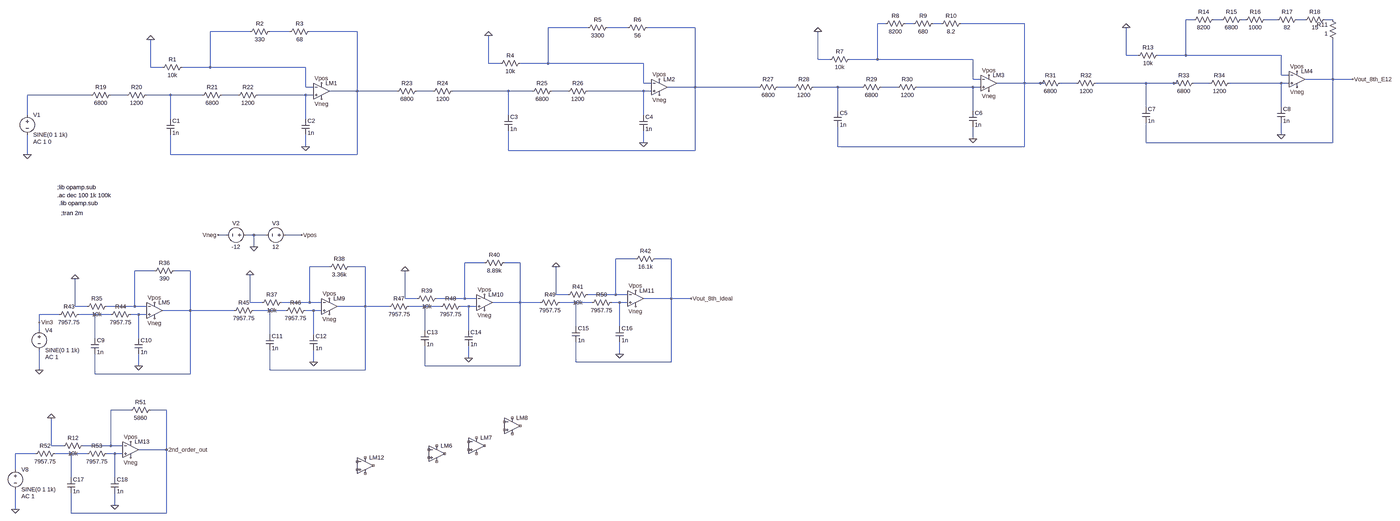
[diagram p0: schematic ESP Prac 1 BW 8th order Anti-Aliasing Filter.asc, whole sheet]
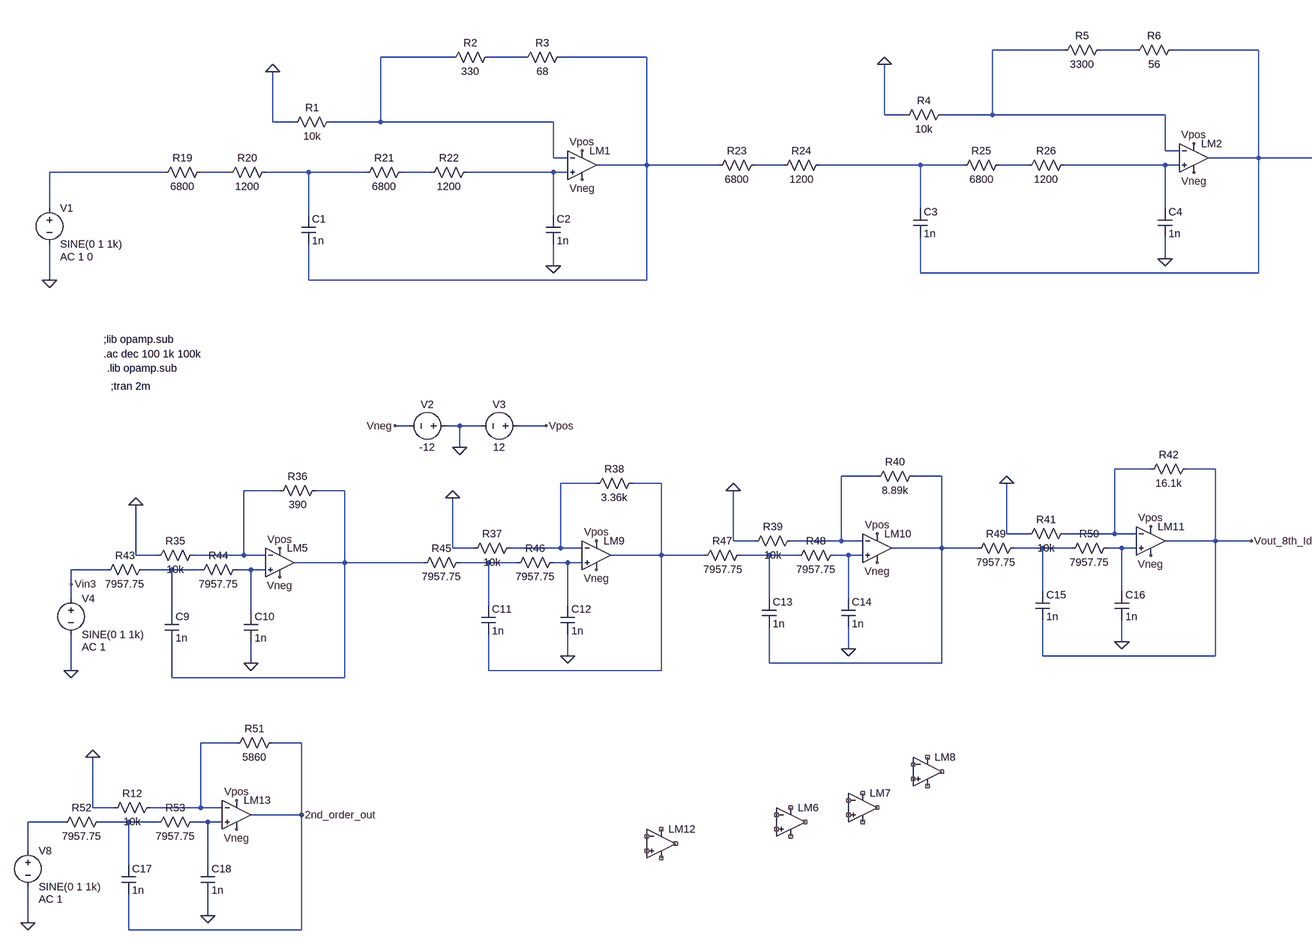
[diagram p1: schematic ESP Prac 1 BW 8th order Anti-Aliasing Filter.asc, part, row 1 of 1, column 1 of 2]
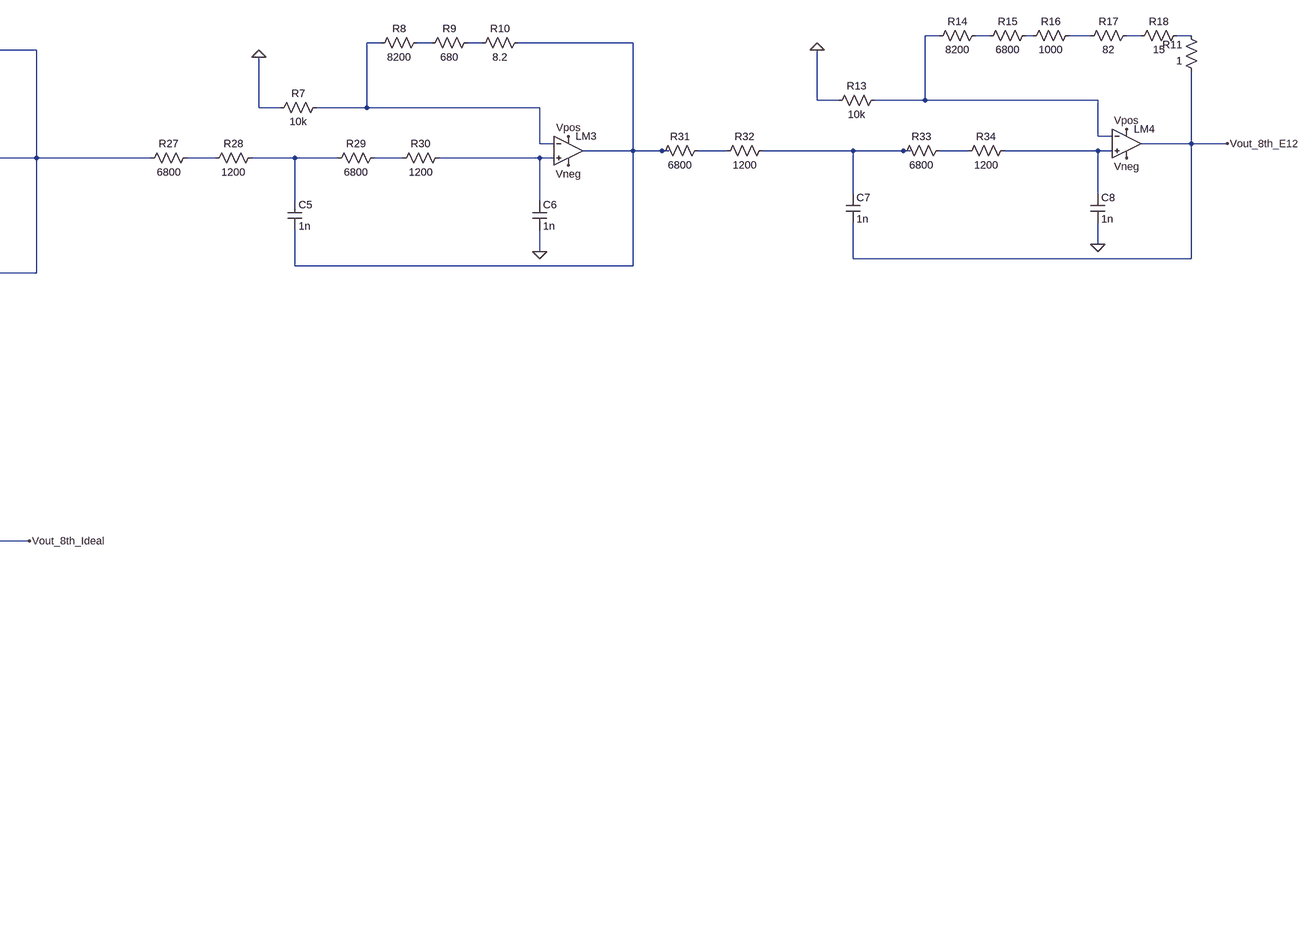
[diagram p2: schematic ESP Prac 1 BW 8th order Anti-Aliasing Filter.asc, part, row 1 of 1, column 2 of 2]
ESP Prac 1 BW 8th order Anti-Aliasing Filter.asc, the LTspice schematic file:
Version 4
SHEET 1 4872 1876
WIRE 4048 -160 4016 -160
WIRE 4160 -160 4128 -160
WIRE 4256 -160 4240 -160
WIRE 4384 -160 4336 -160
WIRE 4496 -160 4464 -160
WIRE 4608 -160 4576 -160
WIRE 2704 -144 2672 -144
WIRE 2816 -144 2784 -144
WIRE 2928 -144 2896 -144
WIRE 3264 -144 3008 -144
WIRE 1456 -128 1296 -128
WIRE 1616 -128 1536 -128
WIRE 1888 -128 1696 -128
WIRE 96 -112 -64 -112
WIRE 256 -112 176 -112
WIRE 528 -112 336 -112
WIRE 3776 -16 3776 -128
WIRE 3824 -16 3776 -16
WIRE 4016 -16 4016 -160
WIRE 4016 -16 3904 -16
WIRE 4400 -16 4016 -16
WIRE 2432 0 2432 -112
WIRE 2480 0 2432 0
WIRE 2672 0 2672 -144
WIRE 2672 0 2560 0
WIRE 3056 0 2672 0
WIRE 1056 16 1056 -96
WIRE 1104 16 1056 16
WIRE 1296 16 1296 -128
WIRE 1296 16 1184 16
WIRE 1680 16 1296 16
WIRE -304 32 -304 -80
WIRE -256 32 -304 32
WIRE -64 32 -64 -112
WIRE -64 32 -176 32
WIRE 320 32 -64 32
WIRE 4400 64 4400 -16
WIRE 4432 64 4400 64
WIRE 3056 80 3056 0
WIRE 3088 80 3056 80
WIRE 4608 80 4608 -80
WIRE 4608 80 4496 80
WIRE 4688 80 4608 80
WIRE 1680 96 1680 16
WIRE 1712 96 1680 96
WIRE 3264 96 3264 -144
WIRE 3264 96 3152 96
WIRE 3328 96 3264 96
WIRE 3344 96 3328 96
WIRE 3472 96 3408 96
WIRE 3856 96 3552 96
WIRE 3968 96 3856 96
WIRE 3984 96 3968 96
WIRE 4112 96 4048 96
WIRE 4400 96 4192 96
WIRE 4432 96 4400 96
WIRE 320 112 320 32
WIRE 352 112 320 112
WIRE 1888 112 1888 -128
WIRE 1888 112 1776 112
WIRE 2192 112 1888 112
WIRE 2336 112 2272 112
WIRE 2512 112 2416 112
WIRE 2608 112 2512 112
WIRE 2752 112 2688 112
WIRE 3056 112 2832 112
WIRE 3088 112 3056 112
WIRE 528 128 528 -112
WIRE 528 128 416 128
WIRE 688 128 528 128
WIRE 832 128 768 128
WIRE 1136 128 912 128
WIRE 1232 128 1136 128
WIRE 1376 128 1312 128
WIRE 1680 128 1456 128
WIRE 1712 128 1680 128
WIRE -544 144 -800 144
WIRE -400 144 -464 144
WIRE -224 144 -320 144
WIRE -96 144 -224 144
WIRE 48 144 -16 144
WIRE 320 144 128 144
WIRE 352 144 320 144
WIRE 3856 192 3856 96
WIRE 4400 192 4400 96
WIRE 2512 208 2512 112
WIRE 3056 208 3056 112
WIRE -800 224 -800 144
WIRE 1136 224 1136 128
WIRE 1680 224 1680 128
WIRE -224 240 -224 144
WIRE 320 240 320 144
WIRE 4400 304 4400 256
WIRE 3056 320 3056 272
WIRE 1680 336 1680 288
WIRE 3856 336 3856 256
WIRE 4608 336 4608 80
WIRE 4608 336 3856 336
WIRE 320 352 320 304
WIRE 2512 352 2512 272
WIRE 3264 352 3264 96
WIRE 3264 352 2512 352
WIRE 1136 368 1136 288
WIRE 1888 368 1888 112
WIRE 1888 368 1136 368
WIRE -800 384 -800 304
WIRE -224 384 -224 304
WIRE 528 384 528 128
WIRE 528 384 -224 384
WIRE 0 736 -32 736
WIRE 112 736 80 736
WIRE 160 736 112 736
WIRE 304 736 240 736
WIRE 112 784 112 736
WIRE 1648 832 1568 832
WIRE 1792 832 1728 832
WIRE 1040 848 960 848
WIRE 1184 848 1120 848
WIRE 416 864 336 864
WIRE 560 864 496 864
WIRE -288 880 -368 880
WIRE -144 880 -208 880
WIRE 1328 976 1328 864
WIRE 1376 976 1328 976
WIRE 1568 976 1568 832
WIRE 1568 976 1456 976
WIRE 1616 976 1568 976
WIRE 720 992 720 880
WIRE 768 992 720 992
WIRE 960 992 960 848
WIRE 960 992 848 992
WIRE 1008 992 960 992
WIRE 1792 992 1792 832
WIRE 1792 992 1680 992
WIRE 1872 992 1792 992
WIRE 96 1008 96 896
WIRE 144 1008 96 1008
WIRE 336 1008 336 864
WIRE 336 1008 224 1008
WIRE 384 1008 336 1008
WIRE 1184 1008 1184 848
WIRE 1184 1008 1072 1008
WIRE 1264 1008 1184 1008
WIRE 1408 1008 1344 1008
WIRE 1472 1008 1408 1008
WIRE 1584 1008 1552 1008
WIRE 1616 1008 1584 1008
WIRE -608 1024 -608 912
WIRE -560 1024 -608 1024
WIRE -368 1024 -368 880
WIRE -368 1024 -480 1024
WIRE -320 1024 -368 1024
WIRE 560 1024 560 864
WIRE 560 1024 448 1024
WIRE 656 1024 560 1024
WIRE 800 1024 736 1024
WIRE 864 1024 800 1024
WIRE 976 1024 944 1024
WIRE 1008 1024 976 1024
WIRE -144 1040 -144 880
WIRE -144 1040 -256 1040
WIRE 32 1040 -144 1040
WIRE 176 1040 112 1040
WIRE 240 1040 176 1040
WIRE 352 1040 320 1040
WIRE 384 1040 352 1040
WIRE -672 1056 -752 1056
WIRE -528 1056 -592 1056
WIRE -464 1056 -528 1056
WIRE -352 1056 -384 1056
WIRE -320 1056 -352 1056
WIRE -752 1088 -752 1056
WIRE 1408 1104 1408 1008
WIRE 1584 1104 1584 1008
WIRE -752 1120 -752 1088
WIRE 800 1120 800 1024
WIRE 976 1120 976 1024
WIRE 176 1136 176 1040
WIRE 352 1136 352 1040
WIRE -528 1152 -528 1056
WIRE -352 1152 -352 1056
WIRE 1584 1216 1584 1168
WIRE 976 1232 976 1184
WIRE 352 1248 352 1200
WIRE 1408 1248 1408 1168
WIRE 1792 1248 1792 992
WIRE 1792 1248 1408 1248
WIRE -352 1264 -352 1216
WIRE 800 1264 800 1184
WIRE 1184 1264 1184 1008
WIRE 1184 1264 800 1264
WIRE -752 1280 -752 1200
WIRE 176 1280 176 1200
WIRE 560 1280 560 1024
WIRE 560 1280 176 1280
WIRE -528 1296 -528 1216
WIRE -144 1296 -144 1040
WIRE -144 1296 -528 1296
WIRE -384 1456 -464 1456
WIRE -240 1456 -304 1456
WIRE -704 1600 -704 1488
WIRE -656 1600 -704 1600
WIRE -464 1600 -464 1456
WIRE -464 1600 -576 1600
WIRE -416 1600 -464 1600
WIRE -240 1616 -240 1456
WIRE -240 1616 -352 1616
WIRE -768 1632 -848 1632
WIRE -624 1632 -688 1632
WIRE -560 1632 -624 1632
WIRE -448 1632 -480 1632
WIRE -416 1632 -448 1632
WIRE -848 1696 -848 1632
WIRE -624 1728 -624 1632
WIRE -448 1728 -448 1632
WIRE -448 1840 -448 1792
WIRE -848 1856 -848 1776
WIRE -624 1872 -624 1792
WIRE -240 1872 -240 1616
WIRE -240 1872 -624 1872
FLAG 320 352 0
FLAG -304 -80 0
FLAG -800 384 0
FLAG 384 160 Vneg
FLAG 384 96 Vpos
FLAG 1680 336 0
FLAG 1056 -96 0
FLAG 1744 144 Vneg
FLAG 1744 80 Vpos
FLAG 3056 320 0
FLAG 2432 -112 0
FLAG 3120 128 Vneg
FLAG 3120 64 Vpos
FLAG 4400 304 0
FLAG 3776 -128 0
FLAG 4464 112 Vneg
FLAG 4464 48 Vpos
FLAG 4688 80 Vout_8th_E12
FLAG 112 784 0
FLAG 304 736 Vpos
FLAG -32 736 Vneg
FLAG -352 1264 0
FLAG -608 912 0
FLAG -752 1280 0
FLAG 352 1248 0
FLAG 96 896 0
FLAG 976 1232 0
FLAG 720 880 0
FLAG 1584 1216 0
FLAG 1328 864 0
FLAG -288 1008 Vpos
FLAG 416 992 Vpos
FLAG 1040 976 Vpos
FLAG 1648 960 Vpos
FLAG 1648 1024 Vneg
FLAG 1040 1040 Vneg
FLAG 416 1056 Vneg
FLAG -288 1072 Vneg
FLAG 1872 992 Vout_8th_Ideal
FLAG -752 1088 Vin3
FLAG -448 1840 0
FLAG -704 1488 0
FLAG -848 1856 0
FLAG -384 1584 Vpos
FLAG -384 1648 Vneg
FLAG -240 1616 2nd_order_out
DATAFLAG 4672 80 ""
DATAFLAG 4672 80 ""
DATAFLAG -80 1040 ""
DATAFLAG -80 1040 ""
DATAFLAG 624 1024 ""
DATAFLAG 624 1024 ""
DATAFLAG 1248 1008 ""
DATAFLAG 1248 1008 ""
SYMBOL res -160 16 R90
WINDOW 0 0 56 VBottom 2
WINDOW 3 32 56 VTop 2
SYMATTR InstName R1
SYMATTR Value 10k
SYMBOL cap -240 240 R0
SYMATTR InstName C1
SYMATTR Value 1n
SYMBOL cap 304 240 R0
SYMATTR InstName C2
SYMATTR Value 1n
SYMBOL voltage -800 208 R0
WINDOW 123 24 124 Left 2
WINDOW 39 0 0 Left 0
SYMATTR Value2 AC 1 0
SYMATTR InstName V1
SYMATTR Value SINE(0 1 1k)
SYMBOL Opamps\\UniversalOpamp2 384 128 R0
SYMATTR InstName LM1
SYMATTR SpiceModel level.1
SYMATTR Value2 Avol=1Meg GBW=1Meg Slew=0.5
SYMATTR SpiceLine ilimit=25m rail=0 Vos=7m phimargin=45
SYMBOL res 192 -128 R90
WINDOW 0 0 56 VBottom 2
WINDOW 3 32 56 VTop 2
SYMATTR InstName R2
SYMATTR Value 330
SYMBOL res 352 -128 R90
WINDOW 0 0 56 VBottom 2
WINDOW 3 32 56 VTop 2
SYMATTR InstName R3
SYMATTR Value 68
SYMBOL res 1200 0 R90
WINDOW 0 0 56 VBottom 2
WINDOW 3 32 56 VTop 2
SYMATTR InstName R4
SYMATTR Value 10k
SYMBOL cap 1120 224 R0
SYMATTR InstName C3
SYMATTR Value 1n
SYMBOL cap 1664 224 R0
SYMATTR InstName C4
SYMATTR Value 1n
SYMBOL Opamps\\UniversalOpamp2 1744 112 R0
SYMATTR InstName LM2
SYMATTR SpiceModel level.1
SYMATTR Value2 Avol=1Meg GBW=1Meg Slew=0.5
SYMATTR SpiceLine ilimit=25m rail=0 Vos=7m phimargin=45
SYMBOL res 1552 -144 R90
WINDOW 0 0 56 VBottom 2
WINDOW 3 32 56 VTop 2
SYMATTR InstName R5
SYMATTR Value 3300
SYMBOL res 1712 -144 R90
WINDOW 0 0 56 VBottom 2
WINDOW 3 32 56 VTop 2
SYMATTR InstName R6
SYMATTR Value 56
SYMBOL res 2576 -16 R90
WINDOW 0 0 56 VBottom 2
WINDOW 3 32 56 VTop 2
SYMATTR InstName R7
SYMATTR Value 10k
SYMBOL cap 2496 208 R0
SYMATTR InstName C5
SYMATTR Value 1n
SYMBOL cap 3040 208 R0
SYMATTR InstName C6
SYMATTR Value 1n
SYMBOL Opamps\\UniversalOpamp2 3120 96 R0
SYMATTR InstName LM3
SYMATTR SpiceModel level.1
SYMATTR Value2 Avol=1Meg GBW=1Meg Slew=0.5
SYMATTR SpiceLine ilimit=25m rail=0 Vos=7m phimargin=45
SYMBOL res 2800 -160 R90
WINDOW 0 0 56 VBottom 2
WINDOW 3 32 56 VTop 2
SYMATTR InstName R8
SYMATTR Value 8200
SYMBOL res 2912 -160 R90
WINDOW 0 0 56 VBottom 2
WINDOW 3 32 56 VTop 2
SYMATTR InstName R9
SYMATTR Value 680
SYMBOL res 3024 -160 R90
WINDOW 0 0 56 VBottom 2
WINDOW 3 32 56 VTop 2
SYMATTR InstName R10
SYMATTR Value 8.2
SYMBOL res 3920 -32 R90
WINDOW 0 0 56 VBottom 2
WINDOW 3 32 56 VTop 2
SYMATTR InstName R13
SYMATTR Value 10k
SYMBOL cap 3840 192 R0
SYMATTR InstName C7
SYMATTR Value 1n
SYMBOL cap 4384 192 R0
SYMATTR InstName C8
SYMATTR Value 1n
SYMBOL Opamps\\UniversalOpamp2 4464 80 R0
SYMATTR InstName LM4
SYMATTR SpiceModel level.1
SYMATTR Value2 Avol=1Meg GBW=1Meg Slew=0.5
SYMATTR SpiceLine ilimit=25m rail=0 Vos=7m phimargin=45
SYMBOL res 4144 -176 R90
WINDOW 0 0 56 VBottom 2
WINDOW 3 32 56 VTop 2
SYMATTR InstName R14
SYMATTR Value 8200
SYMBOL res 4256 -176 R90
WINDOW 0 0 56 VBottom 2
WINDOW 3 32 56 VTop 2
SYMATTR InstName R15
SYMATTR Value 6800
SYMBOL res 4352 -176 R90
WINDOW 0 0 56 VBottom 2
WINDOW 3 32 56 VTop 2
SYMATTR InstName R16
SYMATTR Value 1000
SYMBOL res 4480 -176 R90
WINDOW 0 0 56 VBottom 2
WINDOW 3 32 56 VTop 2
SYMATTR InstName R17
SYMATTR Value 82
SYMBOL res 4592 -176 R90
WINDOW 0 0 56 VBottom 2
WINDOW 3 32 56 VTop 2
SYMATTR InstName R18
SYMATTR Value 15
SYMBOL res -448 128 R90
WINDOW 0 0 56 VBottom 2
WINDOW 3 32 56 VTop 2
SYMATTR InstName R19
SYMATTR Value 6800
SYMBOL res -304 128 R90
WINDOW 0 0 56 VBottom 2
WINDOW 3 32 56 VTop 2
SYMATTR InstName R20
SYMATTR Value 1200
SYMBOL res 0 128 R90
WINDOW 0 0 56 VBottom 2
WINDOW 3 32 56 VTop 2
SYMATTR InstName R21
SYMATTR Value 6800
SYMBOL res 144 128 R90
WINDOW 0 0 56 VBottom 2
WINDOW 3 32 56 VTop 2
SYMATTR InstName R22
SYMATTR Value 1200
SYMBOL res 784 112 R90
WINDOW 0 0 56 VBottom 2
WINDOW 3 32 56 VTop 2
SYMATTR InstName R23
SYMATTR Value 6800
SYMBOL res 928 112 R90
WINDOW 0 0 56 VBottom 2
WINDOW 3 32 56 VTop 2
SYMATTR InstName R24
SYMATTR Value 1200
SYMBOL res 1328 112 R90
WINDOW 0 0 56 VBottom 2
WINDOW 3 32 56 VTop 2
SYMATTR InstName R25
SYMATTR Value 6800
SYMBOL res 1472 112 R90
WINDOW 0 0 56 VBottom 2
WINDOW 3 32 56 VTop 2
SYMATTR InstName R26
SYMATTR Value 1200
SYMBOL res 2288 96 R90
WINDOW 0 0 56 VBottom 2
WINDOW 3 32 56 VTop 2
SYMATTR InstName R27
SYMATTR Value 6800
SYMBOL res 2432 96 R90
WINDOW 0 0 56 VBottom 2
WINDOW 3 32 56 VTop 2
SYMATTR InstName R28
SYMATTR Value 1200
SYMBOL res 2704 96 R90
WINDOW 0 0 56 VBottom 2
WINDOW 3 32 56 VTop 2
SYMATTR InstName R29
SYMATTR Value 6800
SYMBOL res 2848 96 R90
WINDOW 0 0 56 VBottom 2
WINDOW 3 32 56 VTop 2
SYMATTR InstName R30
SYMATTR Value 1200
SYMBOL res 3424 80 R90
WINDOW 0 0 56 VBottom 2
WINDOW 3 32 56 VTop 2
SYMATTR InstName R31
SYMATTR Value 6800
SYMBOL res 3568 80 R90
WINDOW 0 0 56 VBottom 2
WINDOW 3 32 56 VTop 2
SYMATTR InstName R32
SYMATTR Value 1200
SYMBOL res 4064 80 R90
WINDOW 0 0 56 VBottom 2
WINDOW 3 32 56 VTop 2
SYMATTR InstName R33
SYMATTR Value 6800
SYMBOL res 4208 80 R90
WINDOW 0 0 56 VBottom 2
WINDOW 3 32 56 VTop 2
SYMATTR InstName R34
SYMATTR Value 1200
SYMBOL voltage 96 736 R90
WINDOW 0 -32 56 VBottom 2
WINDOW 3 32 56 VTop 2
WINDOW 123 0 0 Left 0
WINDOW 39 0 0 Left 0
SYMATTR InstName V2
SYMATTR Value -12
SYMBOL voltage 256 736 R90
WINDOW 0 -32 56 VBottom 2
WINDOW 3 32 56 VTop 2
WINDOW 123 0 0 Left 0
WINDOW 39 0 0 Left 0
SYMATTR InstName V3
SYMATTR Value 12
SYMBOL res -464 1008 R90
WINDOW 0 0 56 VBottom 2
WINDOW 3 32 56 VTop 2
SYMATTR InstName R35
SYMATTR Value 10k
SYMBOL res -192 864 R90
WINDOW 0 0 56 VBottom 2
WINDOW 3 32 56 VTop 2
SYMATTR InstName R36
SYMATTR Value 390
SYMBOL cap -544 1152 R0
SYMATTR InstName C9
SYMATTR Value 1n
SYMBOL cap -368 1152 R0
SYMATTR InstName C10
SYMATTR Value 1n
SYMBOL voltage -752 1104 R0
WINDOW 123 24 124 Left 2
WINDOW 39 0 0 Left 0
SYMATTR Value2 AC 1
SYMATTR InstName V4
SYMATTR Value SINE(0 1 1k)
SYMBOL res 240 992 R90
WINDOW 0 0 56 VBottom 2
WINDOW 3 32 56 VTop 2
SYMATTR InstName R37
SYMATTR Value 10k
SYMBOL res 512 848 R90
WINDOW 0 0 56 VBottom 2
WINDOW 3 32 56 VTop 2
SYMATTR InstName R38
SYMATTR Value 3.36k
SYMBOL cap 160 1136 R0
SYMATTR InstName C11
SYMATTR Value 1n
SYMBOL cap 336 1136 R0
SYMATTR InstName C12
SYMATTR Value 1n
SYMBOL res 864 976 R90
WINDOW 0 0 56 VBottom 2
WINDOW 3 32 56 VTop 2
SYMATTR InstName R39
SYMATTR Value 10k
SYMBOL res 1136 832 R90
WINDOW 0 0 56 VBottom 2
WINDOW 3 32 56 VTop 2
SYMATTR InstName R40
SYMATTR Value 8.89k
SYMBOL cap 784 1120 R0
SYMATTR InstName C13
SYMATTR Value 1n
SYMBOL cap 960 1120 R0
SYMATTR InstName C14
SYMATTR Value 1n
SYMBOL res 1472 960 R90
WINDOW 0 0 56 VBottom 2
WINDOW 3 32 56 VTop 2
SYMATTR InstName R41
SYMATTR Value 10k
SYMBOL res 1744 816 R90
WINDOW 0 0 56 VBottom 2
WINDOW 3 32 56 VTop 2
SYMATTR InstName R42
SYMATTR Value 16.1k
SYMBOL cap 1392 1104 R0
SYMATTR InstName C15
SYMATTR Value 1n
SYMBOL cap 1568 1104 R0
SYMATTR InstName C16
SYMATTR Value 1n
SYMBOL Opamps\\UniversalOpamp2 -288 1040 R0
SYMATTR InstName LM5
SYMATTR SpiceModel level.1
SYMATTR Value2 Avol=0.1Meg GBW=4Meg Slew=13
SYMATTR SpiceLine ilimit=25m rail=0 Vos=10m phimargin=45
SYMATTR SpiceLine2 en=0 enk=0 in=0 ink=0 Rin=1000000Meg
SYMBOL Opamps\\UniversalOpamp2 848 1632 R0
SYMATTR InstName LM6
SYMATTR SpiceModel level.1
SYMATTR Value2 Avol=1Meg GBW=1Meg Slew=0.5
SYMATTR SpiceLine ilimit=25m rail=0 Vos=7m phimargin=45
SYMBOL Opamps\\UniversalOpamp2 1008 1600 R0
SYMATTR InstName LM7
SYMATTR SpiceModel level.1
SYMATTR Value2 Avol=1Meg GBW=1Meg Slew=0.5
SYMATTR SpiceLine ilimit=25m rail=0 Vos=7m phimargin=45
SYMBOL Opamps\\UniversalOpamp2 1152 1520 R0
SYMATTR InstName LM8
SYMATTR SpiceModel level.1
SYMATTR Value2 Avol=1Meg GBW=1Meg Slew=0.5
SYMATTR SpiceLine ilimit=25m rail=0 Vos=7m phimargin=45
SYMBOL res -576 1040 R90
WINDOW 0 0 56 VBottom 2
WINDOW 3 32 56 VTop 2
SYMATTR InstName R43
SYMATTR Value 7957.75
SYMBOL res -368 1040 R90
WINDOW 0 0 56 VBottom 2
WINDOW 3 32 56 VTop 2
SYMATTR InstName R44
SYMATTR Value 7957.75
SYMBOL res 128 1024 R90
WINDOW 0 0 56 VBottom 2
WINDOW 3 32 56 VTop 2
SYMATTR InstName R45
SYMATTR Value 7957.75
SYMBOL res 336 1024 R90
WINDOW 0 0 56 VBottom 2
WINDOW 3 32 56 VTop 2
SYMATTR InstName R46
SYMATTR Value 7957.75
SYMBOL res 752 1008 R90
WINDOW 0 0 56 VBottom 2
WINDOW 3 32 54 VTop 2
SYMATTR InstName R47
SYMATTR Value 7957.75
SYMBOL res 960 1008 R90
WINDOW 0 0 56 VBottom 2
WINDOW 3 32 56 VTop 2
SYMATTR InstName R48
SYMATTR Value 7957.75
SYMBOL res 1360 992 R90
WINDOW 0 0 56 VBottom 2
WINDOW 3 32 56 VTop 2
SYMATTR InstName R49
SYMATTR Value 7957.75
SYMBOL res 1568 992 R90
WINDOW 0 0 56 VBottom 2
WINDOW 3 32 56 VTop 2
SYMATTR InstName R50
SYMATTR Value 7957.75
SYMBOL Opamps\\UniversalOpamp2 416 1024 R0
SYMATTR InstName LM9
SYMATTR SpiceModel level.1
SYMATTR Value2 Avol=0.1Meg GBW=4Meg Slew=13
SYMATTR SpiceLine ilimit=25m rail=0 Vos=10m phimargin=45
SYMATTR SpiceLine2 en=0 enk=0 in=0 ink=0 Rin=1000000Meg
SYMBOL Opamps\\UniversalOpamp2 1040 1008 R0
SYMATTR InstName LM10
SYMATTR SpiceModel level.1
SYMATTR Value2 Avol=0.1Meg GBW=4Meg Slew=13
SYMATTR SpiceLine ilimit=25m rail=0 Vos=10m phimargin=45
SYMATTR SpiceLine2 en=0 enk=0 in=0 ink=0 Rin=1000000Meg
SYMBOL Opamps\\UniversalOpamp2 1648 992 R0
SYMATTR InstName LM11
SYMATTR SpiceModel level.1
SYMATTR Value2 Avol=0.1Meg GBW=4Meg Slew=13
SYMATTR SpiceLine ilimit=25m rail=0 Vos=10m phimargin=45
SYMATTR SpiceLine2 en=0 enk=0 in=0 ink=0 Rin=1000000Meg
SYMBOL Opamps\\UniversalOpamp2 560 1680 R0
SYMATTR InstName LM12
SYMATTR SpiceModel level.1
SYMATTR Value2 Avol=0.1Meg GBW=4Meg Slew=13
SYMATTR SpiceLine ilimit=25m rail=0 Vos=10m phimargin=45
SYMATTR SpiceLine2 en=0 enk=0 in=0 ink=0 Rin=1000000Meg
SYMBOL res 4624 -64 R180
WINDOW 0 36 76 Left 2
WINDOW 3 36 40 Left 2
SYMATTR InstName R11
SYMATTR Value 1
SYMBOL res -560 1584 R90
WINDOW 0 0 56 VBottom 2
WINDOW 3 32 56 VTop 2
SYMATTR InstName R12
SYMATTR Value 10k
SYMBOL res -288 1440 R90
WINDOW 0 0 56 VBottom 2
WINDOW 3 32 56 VTop 2
SYMATTR InstName R51
SYMATTR Value 5860
SYMBOL cap -640 1728 R0
SYMATTR InstName C17
SYMATTR Value 1n
SYMBOL cap -464 1728 R0
SYMATTR InstName C18
SYMATTR Value 1n
SYMBOL voltage -848 1680 R0
WINDOW 123 24 124 Left 2
WINDOW 39 0 0 Left 0
SYMATTR Value2 AC 1
SYMATTR InstName V8
SYMATTR Value SINE(0 1 1k)
SYMBOL Opamps\\UniversalOpamp2 -384 1616 R0
SYMATTR InstName LM13
SYMATTR SpiceModel level.1
SYMATTR Value2 Avol=0.1Meg GBW=4Meg Slew=13
SYMATTR SpiceLine ilimit=25m rail=0 Vos=10m phimargin=45
SYMATTR SpiceLine2 en=0 enk=0 in=0 ink=0 Rin=1000000Meg
SYMBOL res -672 1616 R90
WINDOW 0 0 56 VBottom 2
WINDOW 3 32 56 VTop 2
SYMATTR InstName R52
SYMATTR Value 7957.75
SYMBOL res -464 1616 R90
WINDOW 0 0 56 VBottom 2
WINDOW 3 32 56 VTop 2
SYMATTR InstName R53
SYMATTR Value 7957.75
TEXT -680 544 Left 2 !;lib opamp.sub
TEXT -680 576 Left 2 !.ac dec 100 1k 100k
TEXT -672 608 Left 2 !.lib opamp.sub
TEXT -664 648 Left 2 !;tran 2m

The netlist it stands for:
* ESP Prac 1 BW 8th order Anti-Aliasing Filter.asc
R1 N014 0 10k
C1 N031 N016 1n
C2 N033 0 1n
V1 N029 0 SINE(0 1 1k) AC 1 0
XLM1 N033 N014 Vpos Vneg N016 level.1 Avol=1Meg GBW=1Meg Slew=0.5 ilimit=25m rail=0 Vos=7m phimargin=45 en=0 enk=0 in=0 ink=0 Rin=500Meg  ; pins IN+ IN- V+ V- OUT
R2 N015 N014 330
R3 N016 N015 68
R4 N011 0 10k
C3 N026 N013 1n
C4 N028 0 1n
XLM2 N028 N011 Vpos Vneg N013 level.1 Avol=1Meg GBW=1Meg Slew=0.5 ilimit=25m rail=0 Vos=7m phimargin=45 en=0 enk=0 in=0 ink=0 Rin=500Meg  ; pins IN+ IN- V+ V- OUT
R5 N012 N011 3300
R6 N013 N012 56
R7 N007 0 10k
C5 N022 N010 1n
C6 N024 0 1n
XLM3 N024 N007 Vpos Vneg N010 level.1 Avol=1Meg GBW=1Meg Slew=0.5 ilimit=25m rail=0 Vos=7m phimargin=45 en=0 enk=0 in=0 ink=0 Rin=500Meg  ; pins IN+ IN- V+ V- OUT
R8 N008 N007 8200
R9 N009 N008 680
R10 N010 N009 8.2
R13 N001 0 10k
C7 N018 Vout_8th_E12 1n
C8 N020 0 1n
XLM4 N020 N001 Vpos Vneg Vout_8th_E12 level.1 Avol=1Meg GBW=1Meg Slew=0.5 ilimit=25m rail=0 Vos=7m phimargin=45 en=0 enk=0 in=0 ink=0 Rin=500Meg  ; pins IN+ IN- V+ V- OUT
R14 N002 N001 8200
R15 N003 N002 6800
R16 N004 N003 1000
R17 N005 N004 82
R18 N006 N005 15
R19 N030 N029 6800
R20 N031 N030 1200
R21 N032 N031 6800
R22 N033 N032 1200
R23 N025 N016 6800
R24 N026 N025 1200
R25 N027 N026 6800
R26 N028 N027 1200
R27 N021 N013 6800
R28 N022 N021 1200
R29 N023 N022 6800
R30 N024 N023 1200
R31 N017 N010 6800
R32 N018 N017 1200
R33 N019 N018 6800
R34 N020 N019 1200
V2 0 Vneg -12
V3 Vpos 0 12
R35 N039 0 10k
R36 N040 N039 390
C9 N047 N040 1n
C10 N048 0 1n
V4 Vin3 0 SINE(0 1 1k) AC 1
R37 N037 0 10k
R38 N038 N037 3.36k
C11 N045 N038 1n
C12 N046 0 1n
R39 N035 0 10k
R40 N036 N035 8.89k
C13 N043 N036 1n
C14 N044 0 1n
R41 N034 0 10k
R42 Vout_8th_Ideal N034 16.1k
C15 N041 Vout_8th_Ideal 1n
C16 N042 0 1n
XLM5 N048 N039 Vpos Vneg N040 level.1 Avol=0.1Meg GBW=4Meg Slew=13 ilimit=25m rail=0 Vos=10m phimargin=45 en=0 enk=0 in=0 ink=0 Rin=1000000Meg  ; pins IN+ IN- V+ V- OUT
XLM6 NC_01 NC_02 NC_03 NC_04 NC_05 level.1 Avol=1Meg GBW=1Meg Slew=0.5 ilimit=25m rail=0 Vos=7m phimargin=45 en=0 enk=0 in=0 ink=0 Rin=500Meg  ; pins IN+ IN- V+ V- OUT
XLM7 NC_06 NC_07 NC_08 NC_09 NC_10 level.1 Avol=1Meg GBW=1Meg Slew=0.5 ilimit=25m rail=0 Vos=7m phimargin=45 en=0 enk=0 in=0 ink=0 Rin=500Meg  ; pins IN+ IN- V+ V- OUT
XLM8 NC_11 NC_12 NC_13 NC_14 NC_15 level.1 Avol=1Meg GBW=1Meg Slew=0.5 ilimit=25m rail=0 Vos=7m phimargin=45 en=0 enk=0 in=0 ink=0 Rin=500Meg  ; pins IN+ IN- V+ V- OUT
R43 N047 Vin3 7957.75
R44 N048 N047 7957.75
R45 N045 N040 7957.75
R46 N046 N045 7957.75
R47 N043 N038 7957.75
R48 N044 N043 7957.75
R49 N041 N036 7957.75
R50 N042 N041 7957.75
XLM9 N046 N037 Vpos Vneg N038 level.1 Avol=0.1Meg GBW=4Meg Slew=13 ilimit=25m rail=0 Vos=10m phimargin=45 en=0 enk=0 in=0 ink=0 Rin=1000000Meg  ; pins IN+ IN- V+ V- OUT
XLM10 N044 N035 Vpos Vneg N036 level.1 Avol=0.1Meg GBW=4Meg Slew=13 ilimit=25m rail=0 Vos=10m phimargin=45 en=0 enk=0 in=0 ink=0 Rin=1000000Meg  ; pins IN+ IN- V+ V- OUT
XLM11 N042 N034 Vpos Vneg Vout_8th_Ideal level.1 Avol=0.1Meg GBW=4Meg Slew=13 ilimit=25m rail=0 Vos=10m phimargin=45 en=0 enk=0 in=0 ink=0 Rin=1000000Meg  ; pins IN+ IN- V+ V- OUT
XLM12 NC_16 NC_17 NC_18 NC_19 NC_20 level.1 Avol=0.1Meg GBW=4Meg Slew=13 ilimit=25m rail=0 Vos=10m phimargin=45 en=0 enk=0 in=0 ink=0 Rin=1000000Meg  ; pins IN+ IN- V+ V- OUT
R11 Vout_8th_E12 N006 1
R12 N049 0 10k
R51 2nd_order_out N049 5860
C17 N051 2nd_order_out 1n
C18 N052 0 1n
V8 N050 0 SINE(0 1 1k) AC 1
XLM13 N052 N049 Vpos Vneg 2nd_order_out level.1 Avol=0.1Meg GBW=4Meg Slew=13 ilimit=25m rail=0 Vos=10m phimargin=45 en=0 enk=0 in=0 ink=0 Rin=1000000Meg  ; pins IN+ IN- V+ V- OUT
R52 N051 N050 7957.75
R53 N052 N051 7957.75
;lib opamp.sub
.ac dec 100 1k 100k
.lib opamp.sub
;tran 2m
.lib UniversalOpamps2.sub
.backanno
.end